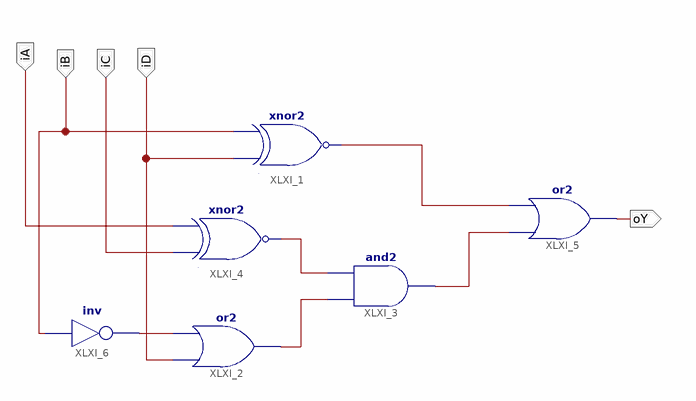
[diagram p0: schematic sheet 1]
// Xilinx ISE schematic behiwiralny_sch.sch (spartan3a) as structural Verilog: 6 symbols, 5 ports
module behiwiralny_sch (
  input  iB,
  input  iD,
  input  iA,
  input  iC,
  output oY
);

  wire XLXN_1, XLXN_2, XLXN_3, XLXN_4, XLXN_5;

  xnor XLXI_1 (XLXN_3, iD, iB);
  or XLXI_2 (XLXN_2, iD, XLXN_5);
  and XLXI_3 (XLXN_4, XLXN_2, XLXN_1);
  xnor XLXI_4 (XLXN_1, iC, iA);
  or XLXI_5 (oY, XLXN_4, XLXN_3);
  not XLXI_6 (XLXN_5, iB);
endmodule
